# Altium schematic sheet RBB_MCU7_V2.2_Connector.SchDoc: <Project Name>
size A3; ApprovedBy: <Appr.>; Author: <Author>; CompanyName: Infineon Technologies AG; Engineer: <Rel.>; Organization: Infineon Technologies AG; Address1: IFAG DES S PS; Address2: Am Campeon 1-12  -  85579 Neubiberg  -  Germany; Address3: 85579 Neubiberg; Address4: Germany; Revision: <Rev.>; SheetNumber: 4; SheetTotal: 4; Release: RC00; PageSetup: Record=PageOptions|CenterHorizontal=True|CenterVertical=True|PrintScale=1.01|XCorrection=1.00|YCorrection=1.00|PrintKind=0|BorderSize=5000000|LeftOffset=0|BottomOffset=0|Orientation=2|PaperLength=1000|PaperWidth=1000|Scale=100|PaperSource=7|PrintQuality=-4|MediaType=1|DitherType=10|PaperKind=A3|PrintScaleMode=1; Doc_ConfidentialStatus: <Doc_ConfidentialStatus>; Doc_Preliminary: <Doc_Preliminary>
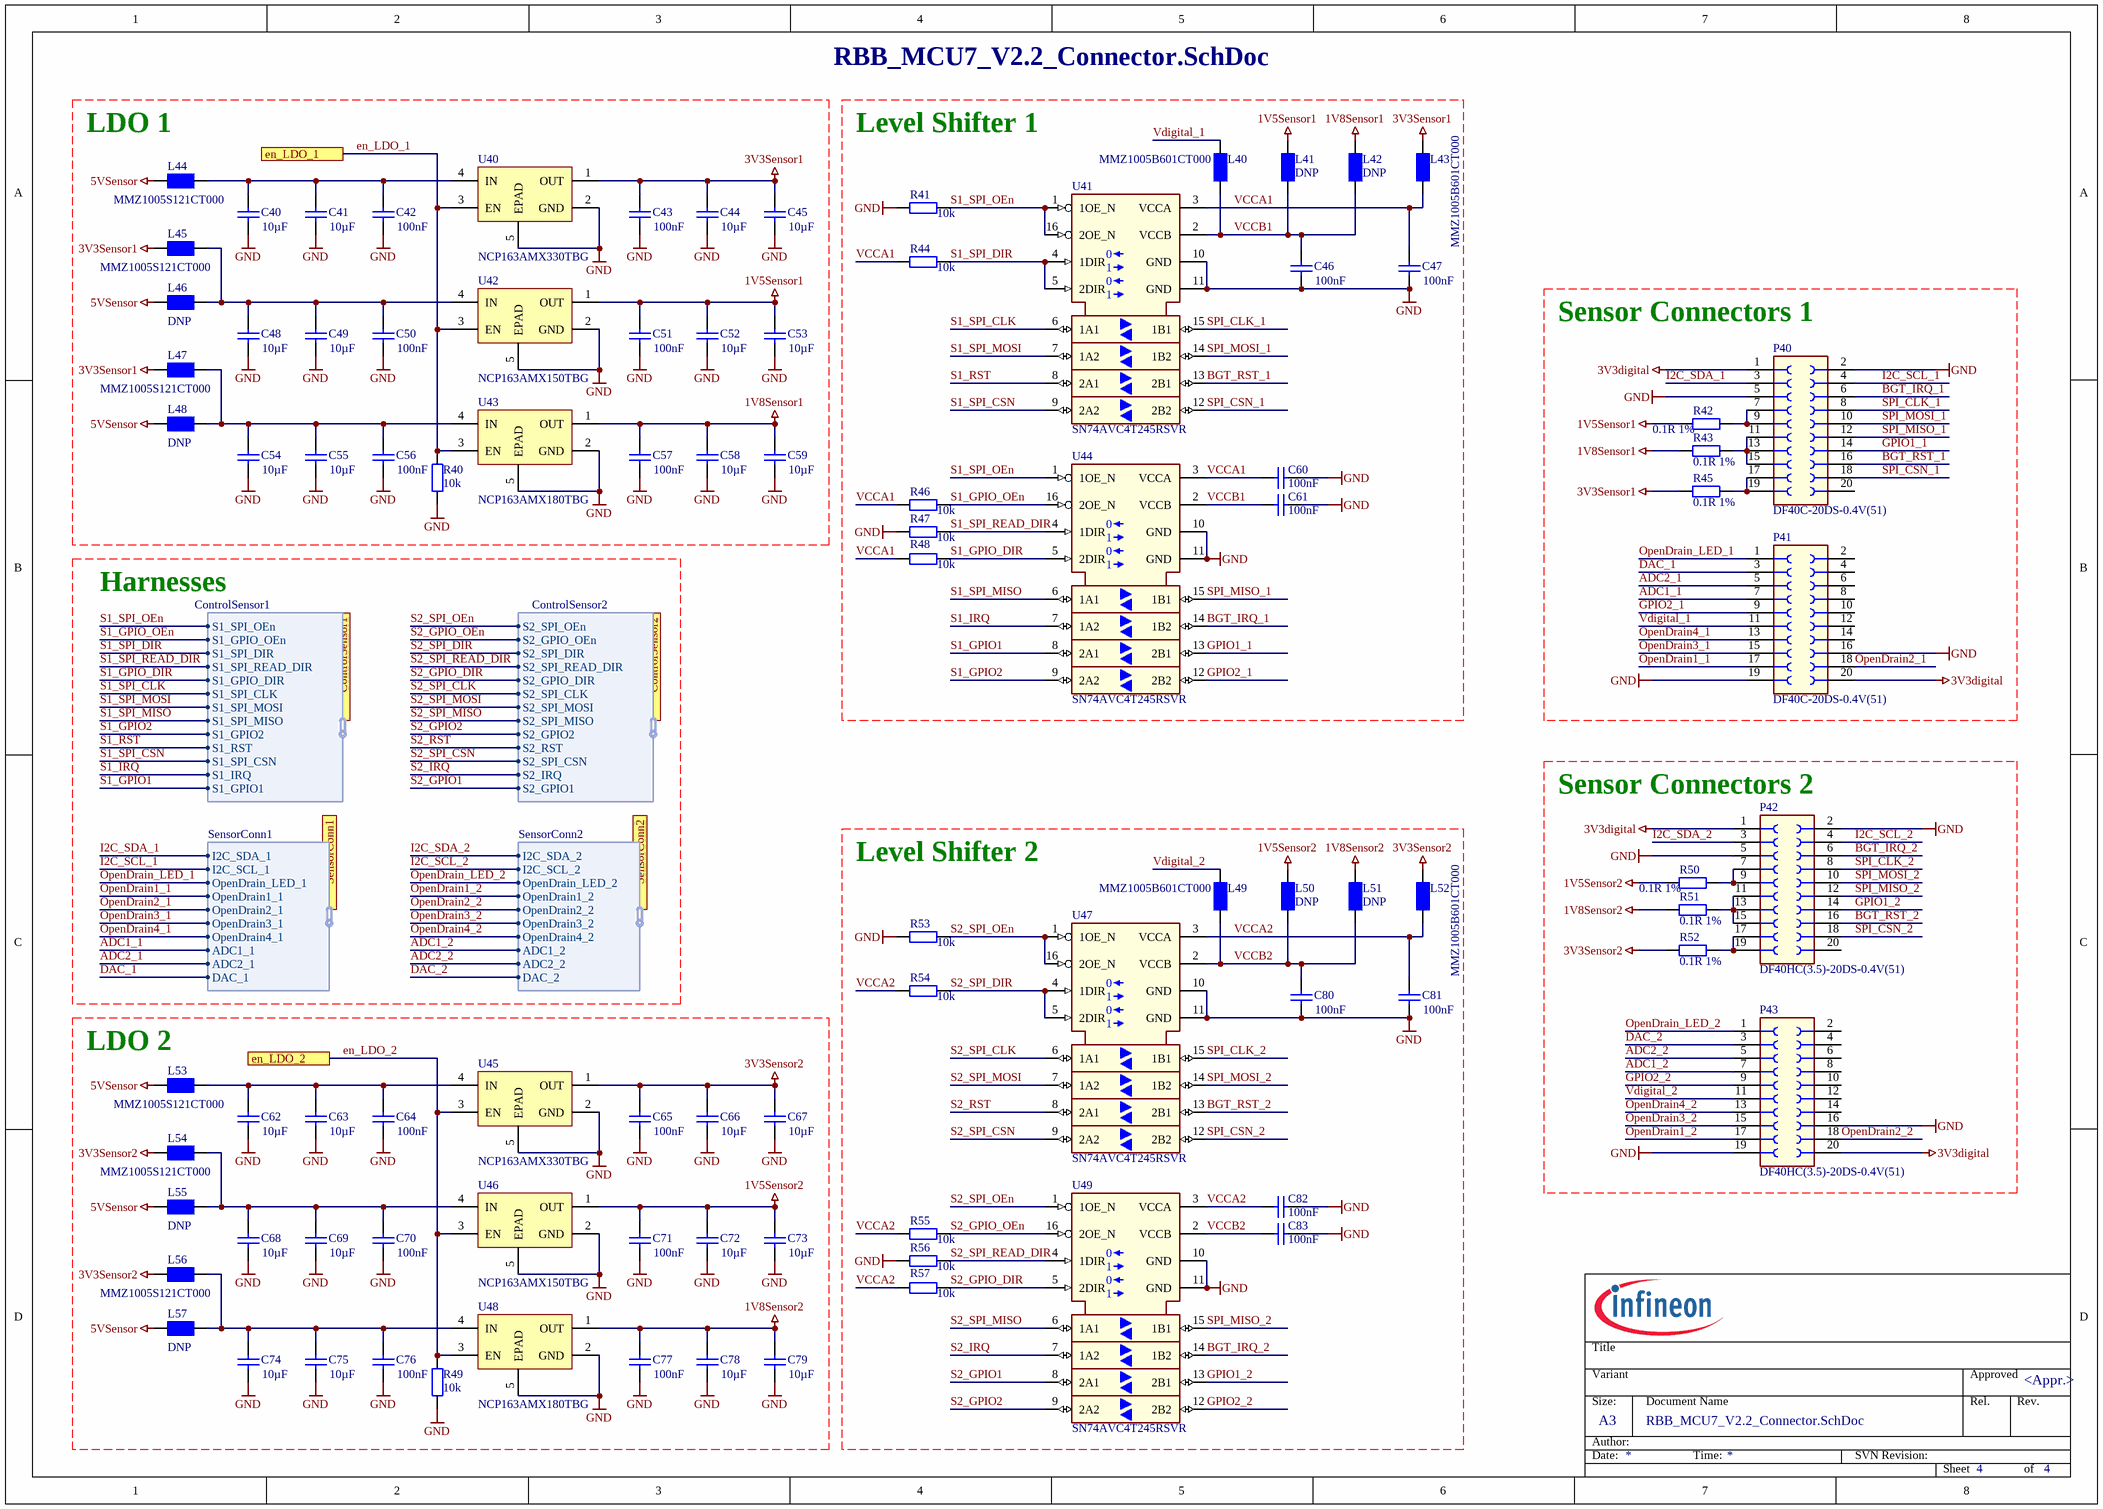
[diagram p0: RBB_MCU7_V2.2_Connector.SchDoc]

## Parts
C40  10µF  [0402_C_Axon]
C41  10µF  [0402_C_Axon]
C42  100nF  [0402_C_Axon]
C43  100nF  [0402_C_Axon]
C44  10µF  [0402_C_Axon]
C45  10µF  [0402_C_Axon]
C46  100nF  [0402_C_Axon]
C47  100nF  [0402_C_Axon]
C48  10µF  [0402_C_Axon]
C49  10µF  [0402_C_Axon]
C50  100nF  [0402_C_Axon]
C51  100nF  [0402_C_Axon]
C52  10µF  [0402_C_Axon]
C53  10µF  [0402_C_Axon]
C54  10µF  [0402_C_Axon]
C55  10µF  [0402_C_Axon]
C56  100nF  [0402_C_Axon]
C57  100nF  [0402_C_Axon]
C58  10µF  [0402_C_Axon]
C59  10µF  [0402_C_Axon]
C60  100nF  [0402_C_Axon]
C61  100nF  [0402_C_Axon]
C62  10µF  [0402_C_Axon]
C63  10µF  [0402_C_Axon]
C64  100nF  [0402_C_Axon]
C65  100nF  [0402_C_Axon]
C66  10µF  [0402_C_Axon]
C67  10µF  [0402_C_Axon]
C68  10µF  [0402_C_Axon]
C69  10µF  [0402_C_Axon]
C70  100nF  [0402_C_Axon]
C71  100nF  [0402_C_Axon]
C72  10µF  [0402_C_Axon]
C73  10µF  [0402_C_Axon]
C74  10µF  [0402_C_Axon]
C75  10µF  [0402_C_Axon]
C76  100nF  [0402_C_Axon]
C77  100nF  [0402_C_Axon]
C78  10µF  [0402_C_Axon]
C79  10µF  [0402_C_Axon]
C80  100nF  [0402_C_Axon]
C81  100nF  [0402_C_Axon]
C82  100nF  [0402_C_Axon]
C83  100nF  [0402_C_Axon]
L40  MMZ1005B601CT000  [0402_L_Axon]
L41  DNP  [0402_Empty_Axon]
L42  DNP  [0402_Empty_Axon]
L43  MMZ1005B601CT000  [0402_L_Axon]
L44  MMZ1005S121CT000  [0402_L_Axon]
L45  MMZ1005S121CT000  [0402_L_Axon]
L46  DNP  [0402_Empty_Axon]
L47  MMZ1005S121CT000  [0402_L_Axon]
L48  DNP  [0402_Empty_Axon]
L49  MMZ1005B601CT000  [0402_L_Axon]
L50  DNP  [0402_Empty_Axon]
L51  DNP  [0402_Empty_Axon]
L52  MMZ1005B601CT000  [0402_L_Axon]
L53  MMZ1005S121CT000  [0402_L_Axon]
L54  MMZ1005S121CT000  [0402_L_Axon]
L55  DNP  [0402_Empty_Axon]
L56  MMZ1005S121CT000  [0402_L_Axon]
L57  DNP  [0402_Empty_Axon]
P40  DF40C-20DS-0.4V(51)  [CON-F-SMD-DF40C-20DS-0.4V(51)]
P41  DF40C-20DS-0.4V(51)  [CON-F-SMD-DF40C-20DS-0.4V(51)]
P42  DF40HC(3.5)-20DS-0.4V(51)  [CON-F-SMD-DF40C-20DS-0.4V(51)]
P43  DF40HC(3.5)-20DS-0.4V(51)  [CON-F-SMD-DF40C-20DS-0.4V(51)]
R40  10k  [0402_R_Axon]
R41  10k  [0402_R_Axon]
R42  0.1R 1%  [0603_R_Axon]
R43  0.1R 1%  [0603_R_Axon]
R44  10k  [0402_R_Axon]
R45  0.1R 1%  [0603_R_Axon]
R46  10k  [0402_R_Axon]
R47  10k  [0402_R_Axon]
R48  10k  [0402_R_Axon]
R49  10k  [0402_R_Axon]
R50  0.1R 1%  [0603_R_Axon]
R51  0.1R 1%  [0603_R_Axon]
R52  0.1R 1%  [0603_R_Axon]
R53  10k  [0402_R_Axon]
R54  10k  [0402_R_Axon]
R55  10k  [0402_R_Axon]
R56  10k  [0402_R_Axon]
R57  10k  [0402_R_Axon]
U40  NCP163AMX330TBG  [NCP163]
U41  SN74AVC4T245RSVR  [SN74AVC4T245RSVR-Hatvan]
U42  NCP163AMX150TBG  [NCP163]
U43  NCP163AMX180TBG  [NCP163]
U44  SN74AVC4T245RSVR  [SN74AVC4T245RSVR-Hatvan]
U45  NCP163AMX330TBG  [NCP163]
U46  NCP163AMX150TBG  [NCP163]
U47  SN74AVC4T245RSVR  [SN74AVC4T245RSVR-Hatvan]
U48  NCP163AMX180TBG  [NCP163]
U49  SN74AVC4T245RSVR  [SN74AVC4T245RSVR-Hatvan]

## Ports
ControlSensor1 (harness ControlSensor1), ControlSensor2 (harness ControlSensor2), en_LDO_1, en_LDO_2, SensorConn1 (harness SensorConn1), SensorConn2 (harness SensorConn2)

## Harnesses
ControlSensor1: S1_SPI_CLK, S1_SPI_MOSI, S1_SPI_MISO, S1_GPIO2, S1_RST, S1_SPI_CSN, S1_IRQ, S1_GPIO1, S1_SPI_OEn, S1_GPIO_OEn, S1_SPI_DIR, S1_SPI_READ_DIR, S1_GPIO_DIR
SensorConn1: I2C_SDA_1, I2C_SCL_1, OpenDrain_LED_1, OpenDrain1_1, OpenDrain2_1, OpenDrain3_1, OpenDrain4_1, ADC1_1, ADC2_1, DAC_1
SensorConn2: I2C_SDA_2, I2C_SCL_2, OpenDrain_LED_2, OpenDrain1_2, OpenDrain2_2, OpenDrain3_2, OpenDrain4_2, ADC1_2, ADC2_2, DAC_2
ControlSensor2: S2_SPI_CLK, S2_SPI_MOSI, S2_SPI_MISO, S2_GPIO2, S2_RST, S2_SPI_CSN, S2_IRQ, S2_GPIO1, S2_SPI_OEn, S2_GPIO_OEn, S2_SPI_DIR, S2_SPI_READ_DIR, S2_GPIO_DIR

## Nets
1V5Sensor1: C51.2 C52.2 C53.2 L41.2 R42.2 U42.1(OUT)
1V5Sensor2: C71.2 C72.2 C73.2 L50.2 R50.2 U46.1(OUT)
1V8Sensor1: C57.2 C58.2 C59.2 L42.2 R43.2 U43.1(OUT)
1V8Sensor2: C77.2 C78.2 C79.2 L51.2 R51.2 U48.1(OUT)
3V3digital: P40.1 P41.20 P42.1 P43.20
3V3Sensor1: C43.2 C44.2 C45.2 L43.2 L45.1 L47.1 R45.2 U40.1(OUT)
3V3Sensor2: C65.2 C66.2 C67.2 L52.2 L54.1 L56.1 R52.2 U45.1(OUT)
5VSensor: L44.1 L46.1 L48.1 L53.1 L55.1 L57.1
GND: C40.1 C41.1 C42.1 C43.1 C44.1 C45.1 C46.1 C47.1 C48.1 C49.1 C50.1 C51.1 C52.1 C53.1 C54.1 C55.1 C56.1 C57.1 C58.1 C59.1 C60.1 C61.1 C62.1 C63.1 C64.1 C65.1 C66.1 C67.1 C68.1 C69.1 C70.1 C71.1 C72.1 C73.1 C74.1 C75.1 C76.1 C77.1 C78.1 C79.1 C80.1 C81.1 C82.1 C83.1 P40.2 P40.5 P41.16 P41.19 P42.2 P42.5 P43.16 P43.19 R40.2 R41.1 R47.1 R49.2 R53.1 R56.1 U40.2(GND) U40.5(EPAD) U41.10(GND) U41.11(GND) U42.2(GND) U42.5(EPAD) U43.2(GND) U43.5(EPAD) U44.10(GND) U44.11(GND) U45.2(GND) U45.5(EPAD) U46.2(GND) U46.5(EPAD) U47.10(GND) U47.11(GND) U48.2(GND) U48.5(EPAD) U49.10(GND) U49.11(GND)
ADC1_1: P41.7 ; port SensorConn1.ADC1_1
ADC1_2: P43.7 ; port SensorConn2.ADC1_2
ADC2_1: P41.5 ; port SensorConn1.ADC2_1
ADC2_2: P43.5 ; port SensorConn2.ADC2_2
BGT_IRQ_1: P40.6 U44.14(1B2)
BGT_IRQ_2: P42.6 U49.14(1B2)
BGT_RST_1: P40.16 U41.13(2B1)
BGT_RST_2: P42.16 U47.13(2B1)
DAC_1: P41.3 ; port SensorConn1.DAC_1
DAC_2: P43.3 ; port SensorConn2.DAC_2
en_LDO_1: R40.1 U40.3(EN) U42.3(EN) U43.3(EN) ; port en_LDO_1
en_LDO_2: R49.1 U45.3(EN) U46.3(EN) U48.3(EN) ; port en_LDO_2
GPIO1_1: P40.14 U44.13(2B1)
GPIO1_2: P42.14 U49.13(2B1)
GPIO2_1: P41.9 U44.12(2B2)
GPIO2_2: P43.9 U49.12(2B2)
I2C_SCL_1: P40.4 ; port SensorConn1.I2C_SCL_1
I2C_SCL_2: P42.4 ; port SensorConn2.I2C_SCL_2
I2C_SDA_1: P40.3 ; port SensorConn1.I2C_SDA_1
I2C_SDA_2: P42.3 ; port SensorConn2.I2C_SDA_2
OpenDrain1_1: P41.17 ; port SensorConn1.OpenDrain1_1
OpenDrain1_2: P43.17 ; port SensorConn2.OpenDrain1_2
OpenDrain2_1: P41.18 ; port SensorConn1.OpenDrain2_1
OpenDrain2_2: P43.18 ; port SensorConn2.OpenDrain2_2
OpenDrain3_1: P41.15 ; port SensorConn1.OpenDrain3_1
OpenDrain3_2: P43.15 ; port SensorConn2.OpenDrain3_2
OpenDrain4_1: P41.13 ; port SensorConn1.OpenDrain4_1
OpenDrain4_2: P43.13 ; port SensorConn2.OpenDrain4_2
OpenDrain_LED_1: P41.1 ; port SensorConn1.OpenDrain_LED_1
OpenDrain_LED_2: P43.1 ; port SensorConn2.OpenDrain_LED_2
S1_GPIO1: U44.8(2A1) ; port ControlSensor1.S1_GPIO1
S1_GPIO2: U44.9(2A2) ; port ControlSensor1.S1_GPIO2
S1_GPIO_DIR: R48.2 U44.5(2DIR) ; port ControlSensor1.S1_GPIO_DIR
S1_GPIO_OEn: R46.2 U44.16(2OE_N) ; port ControlSensor1.S1_GPIO_OEn
S1_IRQ: U44.7(1A2) ; port ControlSensor1.S1_IRQ
S1_RST: U41.8(2A1) ; port ControlSensor1.S1_RST
S1_SPI_CLK: U41.6(1A1) ; port ControlSensor1.S1_SPI_CLK
S1_SPI_CSN: U41.9(2A2) ; port ControlSensor1.S1_SPI_CSN
S1_SPI_DIR: R44.2 U41.4(1DIR) U41.5(2DIR) ; port ControlSensor1.S1_SPI_DIR
S1_SPI_MISO: U44.6(1A1) ; port ControlSensor1.S1_SPI_MISO
S1_SPI_MOSI: U41.7(1A2) ; port ControlSensor1.S1_SPI_MOSI
S1_SPI_OEn: R41.2 U41.1(1OE_N) U41.16(2OE_N) U44.1(1OE_N) ; port ControlSensor1.S1_SPI_OEn
S1_SPI_READ_DIR: R47.2 U44.4(1DIR) ; port ControlSensor1.S1_SPI_READ_DIR
S2_GPIO1: U49.8(2A1) ; port ControlSensor2.S2_GPIO1
S2_GPIO2: U49.9(2A2) ; port ControlSensor2.S2_GPIO2
S2_GPIO_DIR: R57.2 U49.5(2DIR) ; port ControlSensor2.S2_GPIO_DIR
S2_GPIO_OEn: R55.2 U49.16(2OE_N) ; port ControlSensor2.S2_GPIO_OEn
S2_IRQ: U49.7(1A2) ; port ControlSensor2.S2_IRQ
S2_RST: U47.8(2A1) ; port ControlSensor2.S2_RST
S2_SPI_CLK: U47.6(1A1) ; port ControlSensor2.S2_SPI_CLK
S2_SPI_CSN: U47.9(2A2) ; port ControlSensor2.S2_SPI_CSN
S2_SPI_DIR: R54.2 U47.4(1DIR) U47.5(2DIR) ; port ControlSensor2.S2_SPI_DIR
S2_SPI_MISO: U49.6(1A1) ; port ControlSensor2.S2_SPI_MISO
S2_SPI_MOSI: U47.7(1A2) ; port ControlSensor2.S2_SPI_MOSI
S2_SPI_OEn: R53.2 U47.1(1OE_N) U47.16(2OE_N) U49.1(1OE_N) ; port ControlSensor2.S2_SPI_OEn
S2_SPI_READ_DIR: R56.2 U49.4(1DIR) ; port ControlSensor2.S2_SPI_READ_DIR
SPI_CLK_1: P40.8 U41.15(1B1)
SPI_CLK_2: P42.8 U47.15(1B1)
SPI_CSN_1: P40.18 U41.12(2B2)
SPI_CSN_2: P42.18 U47.12(2B2)
SPI_MISO_1: P40.12 U44.15(1B1)
SPI_MISO_2: P42.12 U49.15(1B1)
SPI_MOSI_1: P40.10 U41.14(1B2)
SPI_MOSI_2: P42.10 U47.14(1B2)
VCCA1: C47.2 C60.2 L43.1 R44.1 R46.1 R48.1 U41.3(VCCA) U44.3(VCCA)
VCCA2: C81.2 C82.2 L52.1 R54.1 R55.1 R57.1 U47.3(VCCA) U49.3(VCCA)
VCCB1: C46.2 C61.2 L40.1 L41.1 L42.1 U41.2(VCCB) U44.2(VCCB)
VCCB2: C80.2 C83.2 L49.1 L50.1 L51.1 U47.2(VCCB) U49.2(VCCB)
Vdigital_1: L40.2 P41.11
Vdigital_2: L49.2 P43.11
NetC40_2: C40.2 C41.2 C42.2 L44.2 U40.4(IN)
NetC48_2: C48.2 C49.2 C50.2 L45.2 L46.2 U42.4(IN)
NetC54_2: C54.2 C55.2 C56.2 L47.2 L48.2 U43.4(IN)
NetC62_2: C62.2 C63.2 C64.2 L53.2 U45.4(IN)
NetC68_2: C68.2 C69.2 C70.2 L54.2 L55.2 U46.4(IN)
NetC74_2: C74.2 C75.2 C76.2 L56.2 L57.2 U48.4(IN)
NetP40_7: P40.7 P40.9 R42.1
NetP40_11: P40.11 P40.13 P40.15 R43.1
NetP40_17: P40.17 P40.19 R45.1
NetP42_7: P42.7 P42.9 R50.1
NetP42_11: P42.11 P42.13 P42.15 R51.1
NetP42_17: P42.17 P42.19 R52.1

Not connected (* = marked no-connect by the designer): P40 20; P41 2 4 6 8 10 12 14; P42 20; P43 2 4 6 8 10 12 14

## Notes on the sheet
- (near L44) LDO 1
- Level Shifter 1
- (near P40) Sensor Connectors 1
- Harnesses
- (near P42) Sensor Connectors 2
- Level Shifter 2
- (near L53) LDO 2
- Title
- Variant
- Approved
- Date:
- Author:
- Size:
- A3
- Document Name
- Time:
- SVN Revision:
- Rel.
- Rev.
- Sheet
- of
- (in symbol 465616) 0

## Library data of the parts
C40-C83 = Cap: Capacitor; Value: 0402; Published: 8-Jun-2000; LatestRevisionDate: 17-Jul-2002; LatestRevisionNote: Re-released for DXP Platform.; PackageReference: RAD-0.3; Publisher: Altium Limited; PackageDescription: Radial Cap, Thru-Hole; 2 Leads; 0.3 in Pin Spacing
L40-L57 = INDUCTOR1: SMD Ferrite Bead; Preis: 0; Hersteller: Würth; FootprintBOM: 0805; Kleinmengendistributor: Digi-Key; KleinmengendistributorBestellnummer: 732-1601-1-ND
P40 P41 = 526510: Board-to-FPC Connector, 0.4mm pitch, Female; Manufacturer: Hirose Connectors; Manufacturer Component Status: Active; Symbol type: Socket 10X2 pins; Article Number: 526510; Version Number: V01; Legacy DeviceID: HRS_DF40C-20DS-0.4V(51); Combined Parameters: Board-to-Board Socket (female);10x2;Mounting:SMT;Orient:0° (vertical);Shielded:No; QuickPick: 0° (vertical) / Board-to-Board; Style: FFC/FPC; Automotive Qualified: No; ComponentStatus: Released; Second Source allowed: Yes; Voltage DC (max): na; Part Type: Connector; Manufacturer Order Number: DF40C-20DS-0.4V(51); Value: DF40C-20DS-0.4V(51); Type: Board-to-Board; Temperature min: -35; Temperature max: 85; Temperature Range: Military; ROHS Compliant: Y; PackageReference: SMD; ComponentLink1Description: Vendor WebSite; ComponentLink1URL: http://www.hirose.com/; ComponentLink2Description: Datasheet; ComponentLink2URL: http://webnetprod.muc.infineon.com/PCBPortal_Prod/WorkFlows/AltiumComponent/StandardDocumentation?Versionid=526511; Supplier 1: Farnell; Supplier Part Number 1: 2427683; Supplier 2: DigiKey; Supplier Part Number 2: H11619CT-ND; Supplier 3: Mouser; Supplier Part Number 3: 798-DF40C20DS0.4V51; PLMStatus: Active; Package Description: Connector, SMD, 0.4 mm pitch, 20 pin, 6.60 mm L X 2.88 mm W X 1.60 mm H body
P42 P43 = 526510: Board-to-FPC Connector, 0.4mm pitch, Female; Manufacturer: Hirose Connectors; Manufacturer Component Status: Active; Symbol type: Socket 10X2 pins; Article Number: 526510; Version Number: V01; Legacy DeviceID: HRS_DF40HC(3.5)-20DS-0.4V(51); Combined Parameters: Board-to-Board Socket (female);10x2;Mounting:SMT;Orient:0° (vertical);Shielded:No; QuickPick: 0° (vertical) / Board-to-Board; Style: FFC/FPC; Automotive Qualified: No; ComponentStatus: Released; Second Source allowed: Yes; Voltage DC (max): na; Part Type: Connector; Manufacturer Order Number: DF40HC(3.5)-20DS-0.4V(51); Value: DF40HC(3.5)-20DS-0.4V(51); Type: Board-to-Board; Temperature min: -35; Temperature max: 85; Temperature Range: Military; ROHS Compliant: Y; PackageReference: SMD; ComponentLink1Description: Vendor WebSite; ComponentLink1URL: http://www.hirose.com/; ComponentLink2Description: Datasheet; ComponentLink2URL: http://webnetprod.muc.infineon.com/PCBPortal_Prod/WorkFlows/AltiumComponent/StandardDocumentation?Versionid=526511; Supplier 1: Farnell; Supplier 2: DigiKey; Supplier Part Number 2: DF40HC(3.5)-20DS-0.4V(51)-ND; Supplier 3: Mouser; Supplier Part Number 3: 798-DF40HC3520DS04V5; PLMStatus: Active; Package Description: Connector, SMD, 0.4 mm pitch, 20 pin, 6.60 mm L X 2.88 mm W X 3.50 mm H body
R40 R41 R44 R46-R49 R53-R57 = Res2: Resistor; Value: 0402
R42 R43 R45 R50-R52 = Res2: Resistor; Value: 0603; Published: 8-Jun-2000; LatestRevisionDate: 17-Jul-2002; LatestRevisionNote: Re-released for DXP Platform.; PackageReference: AXIAL-0.4; Publisher: Altium Limited; PackageDescription: Axial Device, Thru-Hole; 2 Leads; 0.4 in Pin Spacing
U40 U42 U43 U45 U46 U48 = NCP177: NCP163 - LDO 250mA, XDFN4, / ultra-low noise, high PSRR
U41 U44 U47 U49 = 465616: Dual-Bit Bus Transceiver with Configurable Voltage Translation and 3-State Output; Multiple Parts: No; Legacy PartNumber: IC02601282; Manufacturer: Texas Instruments; Manufacturer Component Status: Active; Article Number: 465616; Version Number: V01; Legacy DeviceID: TI_SN74AVC4T245RSVR; Combined Parameters: Industrial Interface/Transceiver;Vdc min/max:1.2V/3.6V;Iout:50mA;Fmax:100MHz; Second Source allowed: Yes; Voltage DC (max): na; Symbol Type: Dual-Bit Bus Transceiver with Configurable Voltage Translation and 3-State Output; Alternate View: No; Part Type: Integrated Circuit; Manufacturer Order Number: SN74AVC4T245RSVR; Value: SN74AVC4T245RSVR; Type: Interface/Transceiver; Application: Industrial; Temperature min: -40; Temperature max: 85; Temperature Range: Industrial; RoHS Compliant: Y; Automotive Qualified: No; PackageReference: UQFN-16 (RSV); ComponentLink1Description: Vendor WebSite; ComponentLink1URL: http://www.ti.com; ComponentLink2Description: Datasheet; ComponentLink2URL: http://webnetprod.muc.infineon.com/pcbportal_prod/WorkFlows/AltiumComponent/StandardDocumentation?Versionid=465617; Supplier 1: Farnell; Supplier Part Number 1: 2436915; Supplier 2: DigiKey; Supplier Part Number 2: 296-24366-2-ND; Supplier 3: Mouser; Supplier Part Number 3: 595-SN74AVC4T245RSVR; PLMStatus: Active; Package Description: UQFN, 16 Pins, 2.6mm L X 1.8mm W X 0.55mm H body